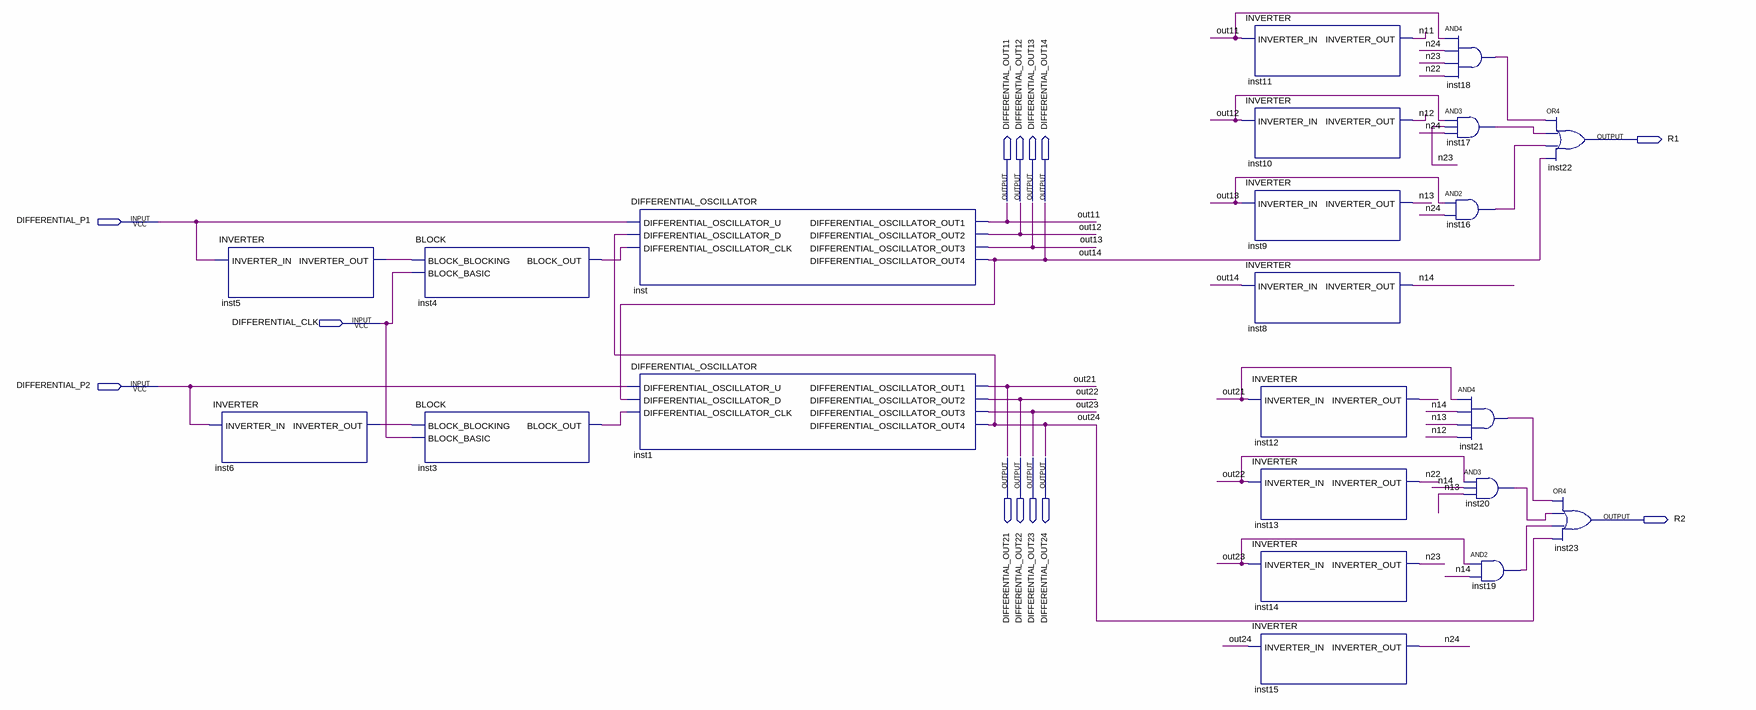
[diagram p0: schematic sheet]
// Quartus schematic DIFFERENTIAL_EX.bdf as structural Verilog: 22 symbols, 13 pins
module DIFFERENTIAL_EX (
  input  DIFFERENTIAL_P1,
  input  DIFFERENTIAL_CLK,
  input  DIFFERENTIAL_P2,
  output R1,
  output DIFFERENTIAL_OUT11,
  output DIFFERENTIAL_OUT12,
  output DIFFERENTIAL_OUT13,
  output DIFFERENTIAL_OUT14,
  output DIFFERENTIAL_OUT21,
  output DIFFERENTIAL_OUT22,
  output DIFFERENTIAL_OUT23,
  output DIFFERENTIAL_OUT24,
  output R2
);

  wire inst3_block_out, inst4_block_out, inst5_inverter_out, inst6_inverter_out, inst12_inverter_out,
       inst16_out, inst17_out, inst18_out, inst19_out, inst20_out, inst21_out, n11, n12, n13, n14, n22, n23,
       n24;

  INVERTER inst5 (.INVERTER_IN(DIFFERENTIAL_P1), .INVERTER_OUT(inst5_inverter_out));
  INVERTER inst6 (.INVERTER_IN(DIFFERENTIAL_P2), .INVERTER_OUT(inst6_inverter_out));
  BLOCK inst4 (.BLOCK_BLOCKING(inst5_inverter_out), .BLOCK_BASIC(DIFFERENTIAL_CLK), .BLOCK_OUT(inst4_block_out));
  BLOCK inst3 (.BLOCK_BLOCKING(inst6_inverter_out), .BLOCK_BASIC(DIFFERENTIAL_CLK), .BLOCK_OUT(inst3_block_out));
  DIFFERENTIAL_OSCILLATOR inst (
    .DIFFERENTIAL_OSCILLATOR_U(DIFFERENTIAL_P1), .DIFFERENTIAL_OSCILLATOR_D(DIFFERENTIAL_OUT24),
    .DIFFERENTIAL_OSCILLATOR_CLK(inst4_block_out), .DIFFERENTIAL_OSCILLATOR_OUT1(DIFFERENTIAL_OUT11),
    .DIFFERENTIAL_OSCILLATOR_OUT2(DIFFERENTIAL_OUT12), .DIFFERENTIAL_OSCILLATOR_OUT3(DIFFERENTIAL_OUT13),
    .DIFFERENTIAL_OSCILLATOR_OUT4(DIFFERENTIAL_OUT14));
  DIFFERENTIAL_OSCILLATOR inst1 (
    .DIFFERENTIAL_OSCILLATOR_U(DIFFERENTIAL_P2), .DIFFERENTIAL_OSCILLATOR_D(DIFFERENTIAL_OUT14),
    .DIFFERENTIAL_OSCILLATOR_CLK(inst3_block_out), .DIFFERENTIAL_OSCILLATOR_OUT1(DIFFERENTIAL_OUT21),
    .DIFFERENTIAL_OSCILLATOR_OUT2(DIFFERENTIAL_OUT22), .DIFFERENTIAL_OSCILLATOR_OUT3(DIFFERENTIAL_OUT23),
    .DIFFERENTIAL_OSCILLATOR_OUT4(DIFFERENTIAL_OUT24));
  INVERTER inst11 (.INVERTER_IN(DIFFERENTIAL_OUT11), .INVERTER_OUT(n11));
  INVERTER inst10 (.INVERTER_IN(DIFFERENTIAL_OUT12), .INVERTER_OUT(n12));
  INVERTER inst9 (.INVERTER_IN(DIFFERENTIAL_OUT13), .INVERTER_OUT(n13));
  INVERTER inst8 (.INVERTER_IN(DIFFERENTIAL_OUT14), .INVERTER_OUT(n14));
  INVERTER inst12 (.INVERTER_IN(DIFFERENTIAL_OUT21), .INVERTER_OUT(inst12_inverter_out));
  INVERTER inst13 (.INVERTER_IN(DIFFERENTIAL_OUT22), .INVERTER_OUT(n22));
  INVERTER inst14 (.INVERTER_IN(DIFFERENTIAL_OUT23), .INVERTER_OUT(n23));
  INVERTER inst15 (.INVERTER_IN(DIFFERENTIAL_OUT24), .INVERTER_OUT(n24));
  and inst18 (inst18_out, DIFFERENTIAL_OUT11, n24, n23, n22);
  and inst17 (inst17_out, DIFFERENTIAL_OUT12, n23, n24);
  and inst16 (inst16_out, DIFFERENTIAL_OUT13, n24);
  and inst21 (inst21_out, DIFFERENTIAL_OUT21, n14, n13, n12);
  and inst20 (inst20_out, DIFFERENTIAL_OUT22, n14, n13);
  and inst19 (inst19_out, DIFFERENTIAL_OUT23, n14);
  or inst22 (R1, inst18_out, inst17_out, inst16_out, DIFFERENTIAL_OUT14);
  or inst23 (R2, inst21_out, inst20_out, inst19_out, DIFFERENTIAL_OUT24);

  // Other names for the same wires on the sheet: out11 = DIFFERENTIAL_OUT11; out12 = DIFFERENTIAL_OUT12;
  //   out13 = DIFFERENTIAL_OUT13; out14 = DIFFERENTIAL_OUT14; out21 = DIFFERENTIAL_OUT21; out22 = DIFFERENTIAL_OUT22;
  //   out23 = DIFFERENTIAL_OUT23; out24 = DIFFERENTIAL_OUT24
endmodule
